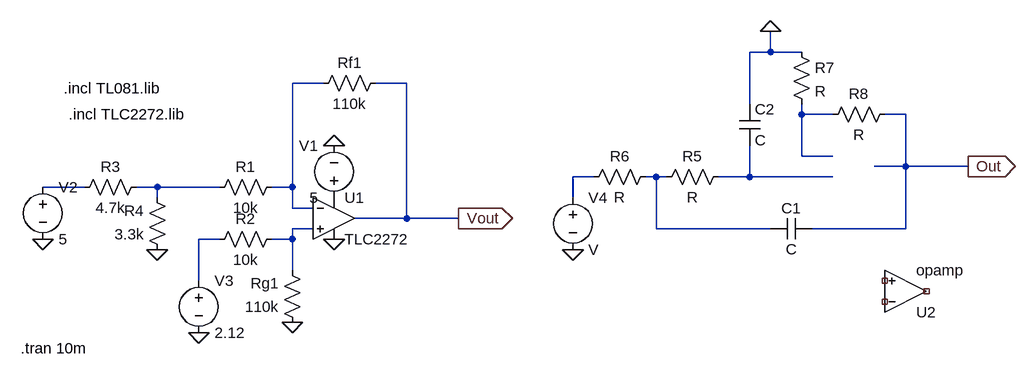
[diagram p0: schematic Draft1.asc]
Draft1.asc, the LTspice schematic file:
Version 4
SHEET 1 1380 680
WIRE 976 -96 976 -128
WIRE 976 -96 944 -96
WIRE 1024 -96 976 -96
WIRE 288 -48 240 -48
WIRE 416 -48 368 -48
WIRE 944 -16 944 -96
WIRE 1024 0 1024 -16
WIRE 1072 0 1024 0
WIRE 1184 0 1152 0
WIRE 1024 64 1024 0
WIRE 1072 64 1024 64
WIRE 1184 80 1184 0
WIRE 1184 80 1136 80
WIRE 1280 80 1184 80
WIRE 704 96 672 96
WIRE 800 96 784 96
WIRE 816 96 800 96
WIRE 944 96 944 48
WIRE 944 96 896 96
WIRE 1072 96 944 96
WIRE -80 112 -144 112
WIRE 32 112 0 112
WIRE 128 112 32 112
WIRE 240 112 240 -48
WIRE 240 112 208 112
WIRE 32 128 32 112
WIRE 672 128 672 96
WIRE 240 144 240 112
WIRE 272 144 240 144
WIRE 416 160 416 -48
WIRE 416 160 336 160
WIRE 496 160 416 160
WIRE 272 176 240 176
WIRE 800 176 800 96
WIRE 976 176 800 176
WIRE 1184 176 1184 80
WIRE 1184 176 1040 176
WIRE 128 192 96 192
WIRE 240 192 240 176
WIRE 240 192 208 192
WIRE 240 240 240 192
WIRE 96 256 96 192
FLAG 496 160 Vout
IOPIN 496 160 Out
FLAG 304 192 0
FLAG 240 320 0
FLAG 304 48 0
FLAG -144 192 0
FLAG 32 208 0
FLAG 96 336 0
FLAG 976 -128 0
FLAG 1280 80 Out
IOPIN 1280 80 Out
FLAG 672 208 0
SYMBOL OpAmps\\opamp2 304 96 R0
SYMATTR InstName U1
SYMATTR Value TLC2272
SYMBOL res 224 96 R90
WINDOW 0 0 56 VBottom 2
WINDOW 3 32 56 VTop 2
SYMATTR InstName R1
SYMATTR Value 10k
SYMBOL res 224 176 R90
WINDOW 0 0 56 VBottom 2
WINDOW 3 32 56 VTop 2
SYMATTR InstName R2
SYMATTR Value 10k
SYMBOL res 256 336 R180
WINDOW 0 36 76 Left 2
WINDOW 3 36 40 Left 2
SYMATTR InstName Rg1
SYMATTR Value 110k
SYMBOL res 272 -32 R270
WINDOW 0 32 56 VTop 2
WINDOW 3 0 56 VBottom 2
SYMATTR InstName Rf1
SYMATTR Value 110k
SYMBOL voltage 304 144 R180
WINDOW 0 24 96 Left 2
WINDOW 3 24 16 Left 2
WINDOW 123 0 0 Left 0
WINDOW 39 0 0 Left 0
SYMATTR InstName V1
SYMATTR Value 5
SYMBOL voltage -144 96 R0
WINDOW 123 0 0 Left 0
WINDOW 39 0 0 Left 0
SYMATTR InstName V2
SYMATTR Value 5
SYMBOL res 16 96 R90
WINDOW 0 0 56 VBottom 2
WINDOW 3 32 56 VTop 2
SYMATTR InstName R3
SYMATTR Value 4.7k
SYMBOL res 48 224 R180
WINDOW 0 36 76 Left 2
WINDOW 3 36 40 Left 2
SYMATTR InstName R4
SYMATTR Value 3.3k
SYMBOL voltage 96 240 R0
WINDOW 123 0 0 Left 0
WINDOW 39 0 0 Left 0
SYMATTR InstName V3
SYMATTR Value 2.12
SYMBOL OpAmps\\opamp 1184 336 M180
SYMATTR InstName U2
SYMBOL res 912 80 R90
WINDOW 0 0 56 VBottom 2
WINDOW 3 32 56 VTop 2
SYMATTR InstName R5
SYMBOL res 800 80 R90
WINDOW 0 0 56 VBottom 2
WINDOW 3 32 56 VTop 2
SYMATTR InstName R6
SYMBOL res 1008 -112 R0
SYMATTR InstName R7
SYMBOL res 1168 -16 R90
WINDOW 0 0 56 VBottom 2
WINDOW 3 32 56 VTop 2
SYMATTR InstName R8
SYMBOL cap 1040 160 R90
WINDOW 0 0 32 VBottom 2
WINDOW 3 32 32 VTop 2
SYMATTR InstName C1
SYMBOL cap 928 -16 R0
SYMATTR InstName C2
SYMBOL voltage 672 112 R0
SYMATTR InstName V4
TEXT -112 -40 Left 2 !.incl TL081.lib
TEXT -104 0 Left 2 !.incl TLC2272.lib
TEXT -178 360 Left 2 !.tran 10m

The netlist it stands for:
* Draft1.asc
XU1 N008 N001 P001 0 Vout TLC2272  ; pins In+ In- V+ V- OUT
R1 N001 N007 10k
R2 N008 N009 10k
Rg1 0 N008 110k
Rf1 N001 Vout 110k
V1 P001 0 5
V2 N006 0 5
R3 N007 N006 4.7k
R4 0 N007 3.3k
V3 N009 0 2.12
XU2 NC_01 NC_02 NC_03 opamp Aol=100K GBW=10Meg  ; pins invin noninvin out
R5 N005 N004 R
R6 N004 N003 R
R7 0 N002 R
R8 Out N002 R
C1 Out N004 C
C2 0 N005 C
V4 N003 0 V
.incl TL081.lib
.incl TLC2272.lib
.tran 10m
.backanno
.end